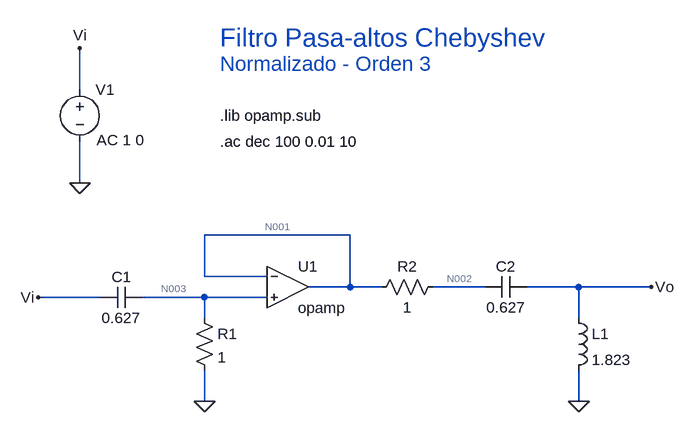
[diagram p0: schematic Circuito_1b.asc]
Circuito_1b.asc, the LTspice schematic file:
Version 4
SHEET 1 940 680
WIRE -32 -176 -32 -240
WIRE -32 -32 -32 -96
WIRE 384 48 160 48
WIRE 160 112 160 48
WIRE 256 112 160 112
WIRE 384 128 384 48
WIRE 384 128 320 128
WIRE 432 128 384 128
WIRE 592 128 512 128
WIRE 736 128 656 128
WIRE 848 128 736 128
WIRE 0 144 -96 144
WIRE 160 144 64 144
WIRE 256 144 160 144
WIRE 160 176 160 144
WIRE 736 176 736 128
WIRE 160 304 160 256
WIRE 736 304 736 256
FLAG 160 304 0
FLAG 736 304 0
FLAG -96 144 Vi
FLAG 848 128 Vo
FLAG -32 -32 0
FLAG -32 -240 Vi
SYMBOL OpAmps\\opamp 288 64 R0
SYMATTR InstName U1
SYMBOL res 528 112 R90
WINDOW 0 0 56 VBottom 2
WINDOW 3 32 56 VTop 2
SYMATTR InstName R2
SYMATTR Value 1
SYMBOL cap 656 112 R90
WINDOW 0 0 32 VBottom 2
WINDOW 3 32 32 VTop 2
SYMATTR InstName C2
SYMATTR Value 0.627
SYMBOL ind 720 160 R0
SYMATTR InstName L1
SYMATTR Value 1.823
SYMBOL voltage -32 -192 R0
WINDOW 123 26 94 Left 2
WINDOW 39 0 0 Left 0
SYMATTR Value2 AC 1 0
SYMATTR InstName V1
SYMATTR Value ""
SYMBOL cap 64 128 R90
WINDOW 0 0 32 VBottom 2
WINDOW 3 32 32 VTop 2
SYMATTR InstName C1
SYMATTR Value 0.627
SYMBOL res 144 160 R0
SYMATTR InstName R1
SYMATTR Value 1
TEXT 184 -136 Left 2 !.lib opamp.sub
TEXT 184 -96 Left 2 !.ac dec 100 0.01 10
TEXT 184 -256 Left 4 ;Filtro Pasa-altos Chebyshev
TEXT 184 -216 Left 3 ;Normalizado - Orden 3

The netlist it stands for:
* Circuito_1b.asc
XU1 N001 N003 N001 opamp Aol=100K GBW=10Meg  ; pins invin noninvin out
R2 N002 N001 1
C2 Vo N002 0.627
L1 Vo 0 1.823
V1 Vi 0 AC 1 0
C1 N003 Vi 0.627
R1 N003 0 1
.lib opamp.sub
.ac dec 100 0.01 10
* Filtro Pasa-altos Chebyshev
* Normalizado - Orden 3
.backanno
.end

* Results of the author's LTspice run, read from the files saved beside the schematic
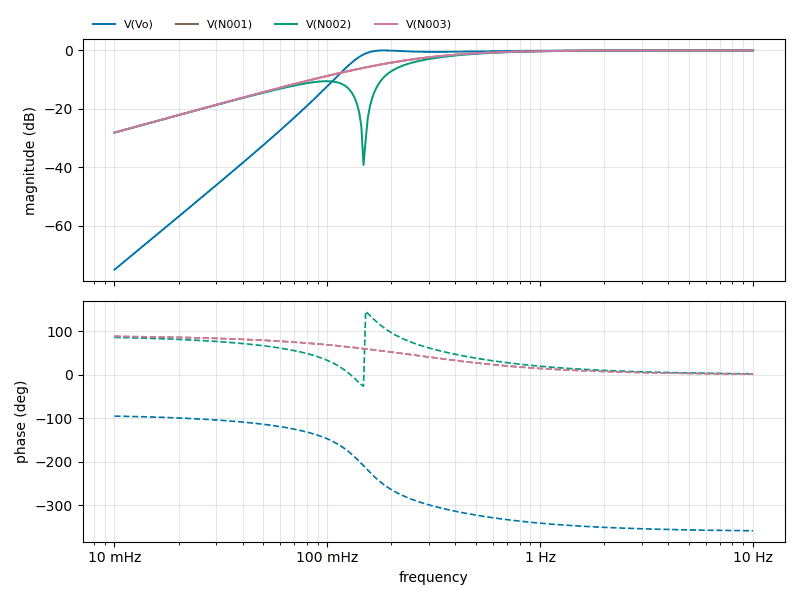
[diagram p1: AC Analysis of Circuito_1b.asc, plotted from the saved traces]
* AC Analysis, 1 run:
*   V(Vo): -74.98 dB at 10 mHz, -0.00 dB at 10 Hz, peak -0.00 dB at 10 Hz, 3 dB below the peak at 136.4 mHz
*   V(N001): -28.10 dB at 10 mHz, -0.00 dB at 10 Hz, peak -0.00 dB at 10 Hz, 3 dB below the peak at 253.7 mHz
*   V(N002): -28.10 dB at 10 mHz, -0.00 dB at 10 Hz, peak -0.00 dB at 10 Hz, 3 dB below the peak at 296.6 mHz
*   V(N003): -28.10 dB at 10 mHz, -0.00 dB at 10 Hz, peak -0.00 dB at 10 Hz, 3 dB below the peak at 253.7 mHz